# EAGLE design arm_route2 (EAGLE 7.6.0)
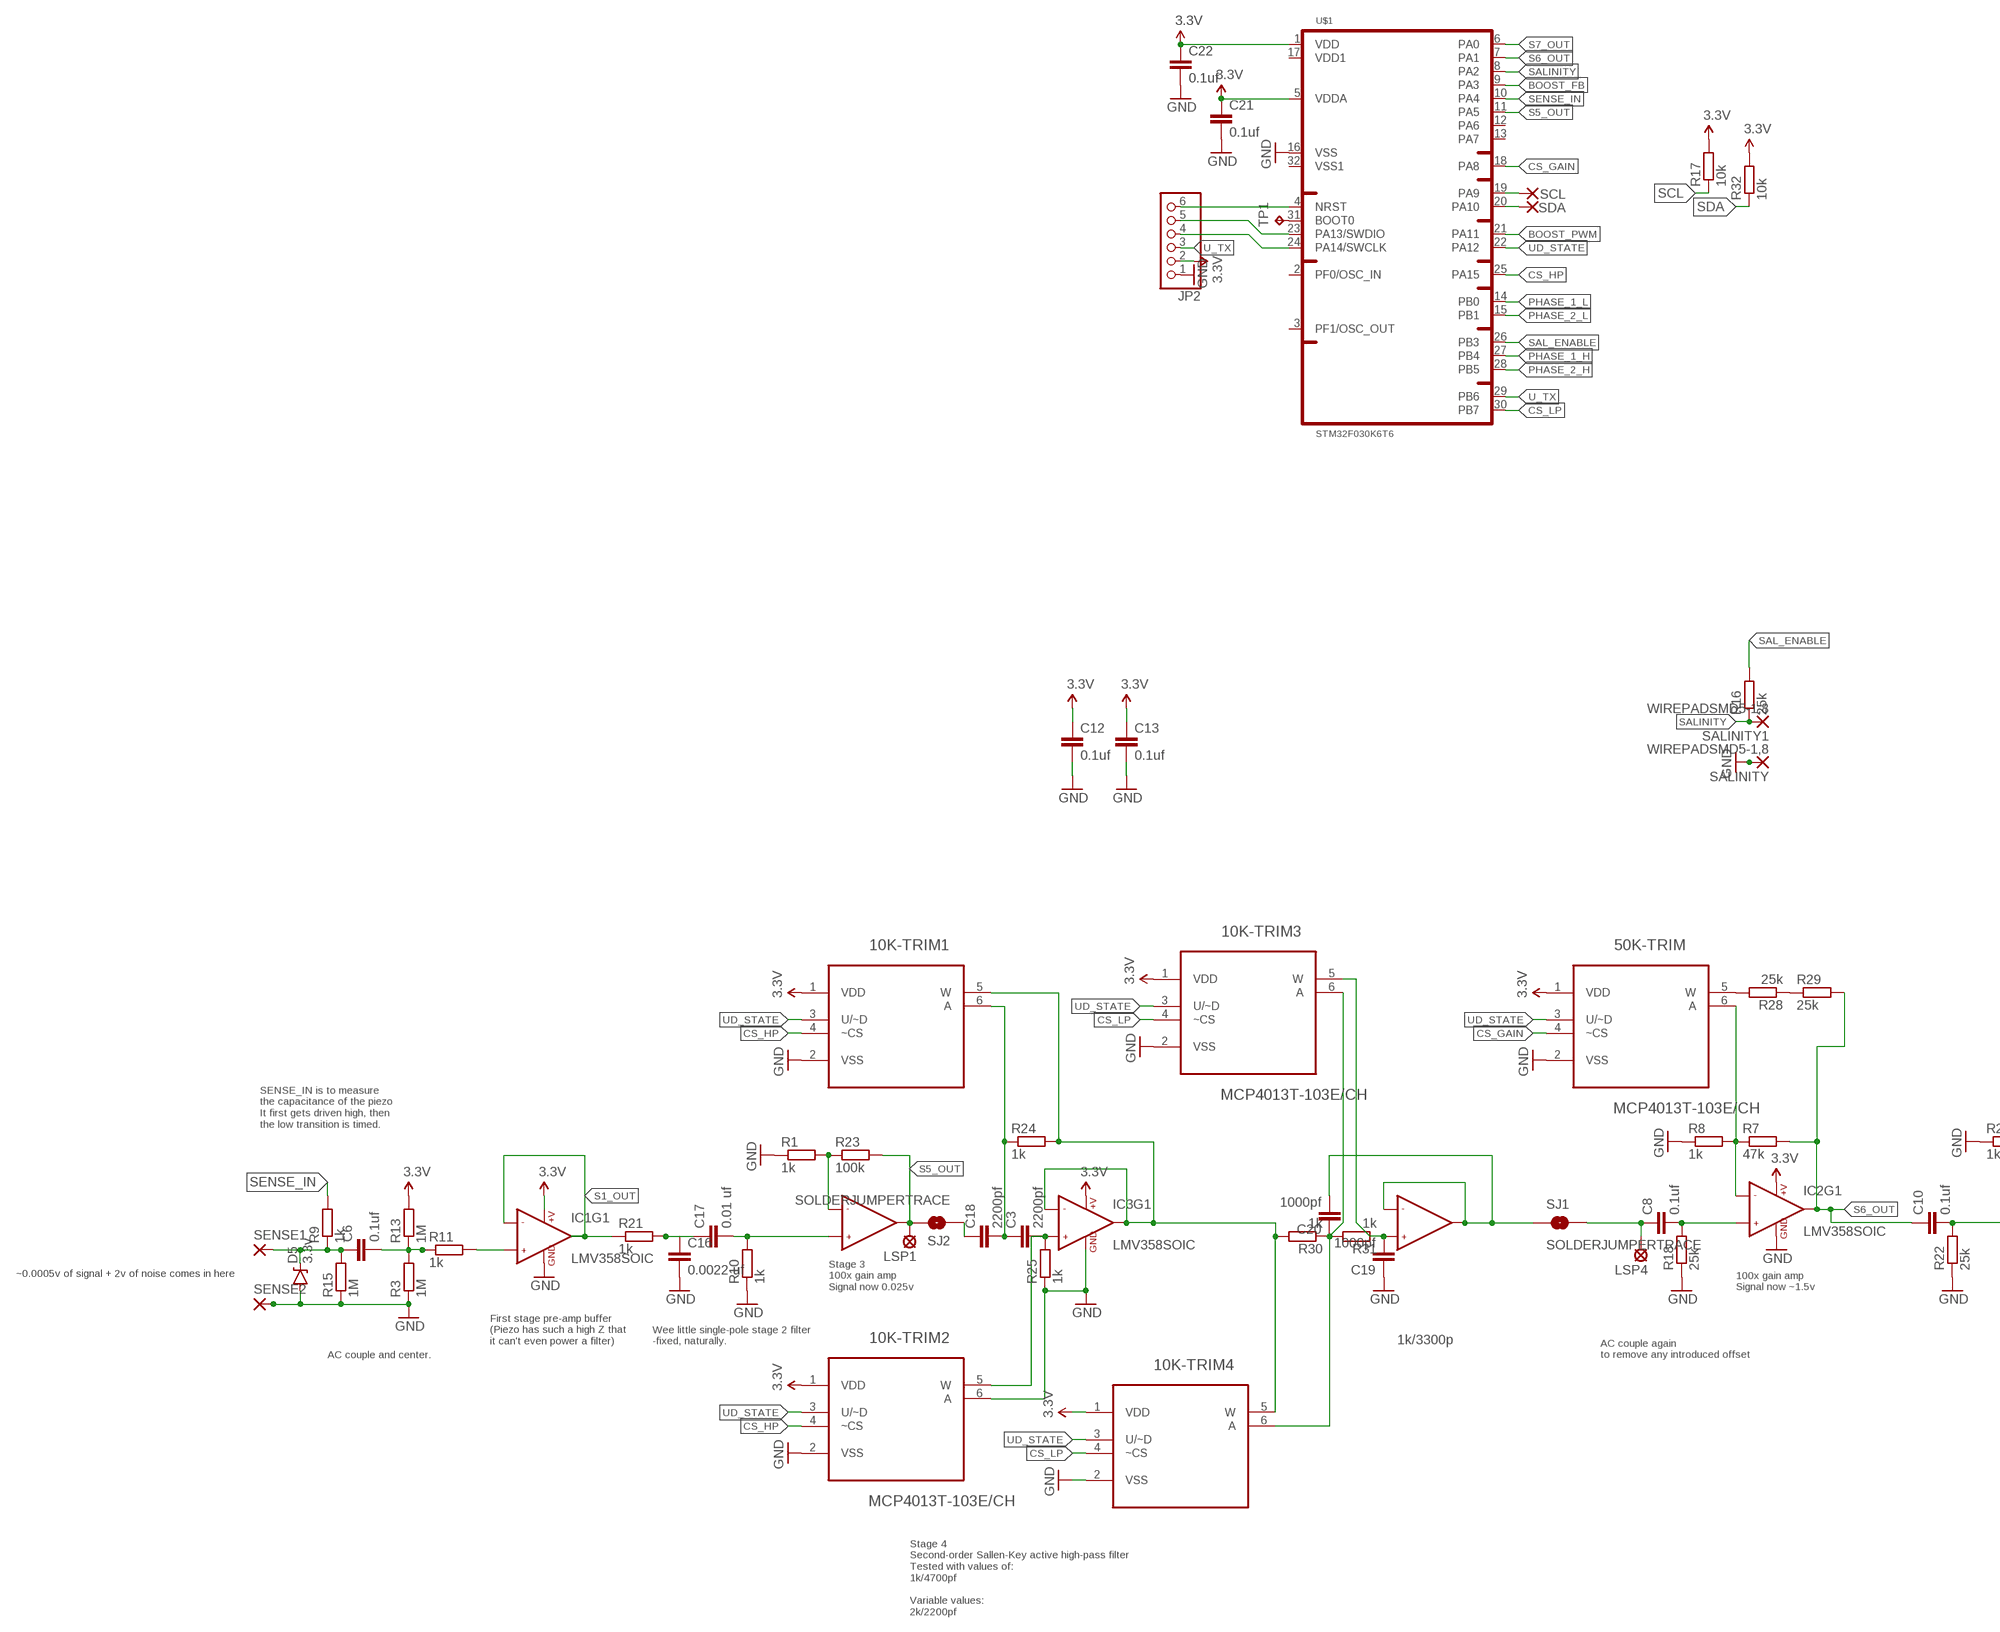
[diagram p0: schematic, sheet 1, part 1 of 2]
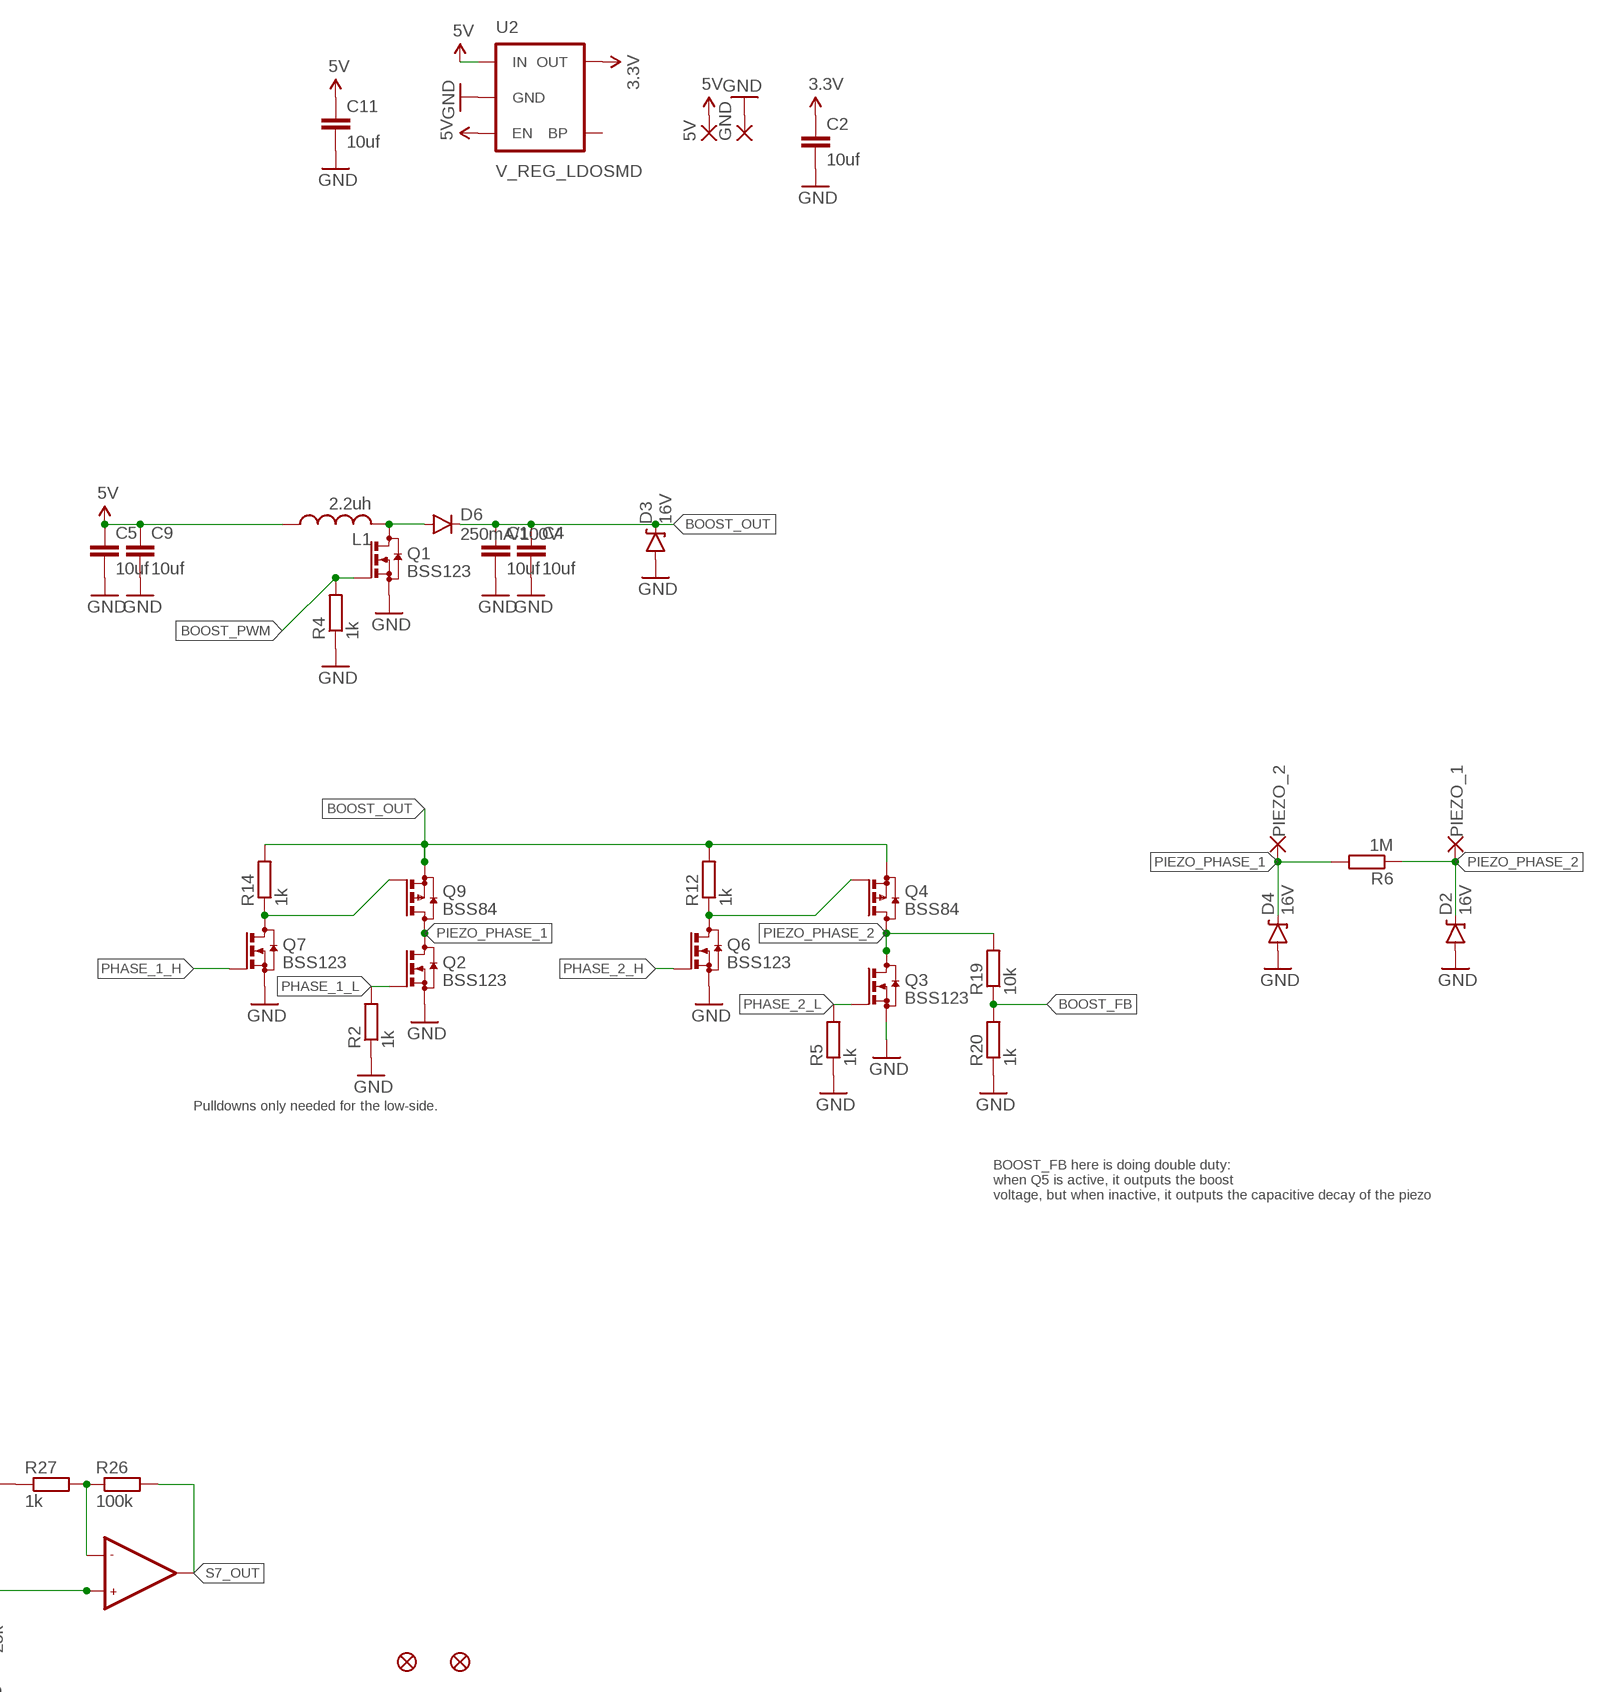
[diagram p1: schematic, sheet 1, part 2 of 2]

## Parts
5V  SMD5  [SMD2,54-5,08]
10K-TRIM1  MCP4013T-103E/CH  [SOT95P280X145-6N]
10K-TRIM2  MCP4013T-103E/CH  [SOT95P280X145-6N]
10K-TRIM3  MCP4013T-103E/CH  [SOT95P280X145-6N]
10K-TRIM4  MCP4013T-103E/CH  [SOT95P280X145-6N]
50K-TRIM  MCP4013T-103E/CH  [SOT95P280X145-6N]
C1  10uf  C-EUC0805  [C0805]
C2  10uf  C-EUC0603  [C0603]
C3  2200pf  C-EUC0603  [C0603]
C4  10uf  C-EUC0805  [C0805]
C5  10uf  C-EUC0603  [C0603]
C6  0.1uf  C-EUC0603  [C0603]
C8  0.1uf  C-EUC0603  [C0603]
C9  10uf  C-EUC0603  [C0603]
C10  0.1uf  C-EUC0603  [C0603]
C11  10uf  C-EUC0603  [C0603]
C12  0.1uf  C-EUC0603  [C0603]
C13  0.1uf  C-EUC0603  [C0603]
C16  0.0022 uf  C-EUC0603  [C0603]
C17  0.01 uf  C-EUC0603  [C0603]
C18  2200pf  C-EUC0603  [C0603]
C19  1000pf  C-EUC0603  [C0603]
C20  1000pf  C-EUC0603  [C0603]
C21  0.1uf  C-EUC0603  [C0603]
C22  0.1uf  C-EUC0603  [C0603]
D2  16V  DIODE-ZENER3.3V  [SOD-323]
D3  16V  DIODE-ZENER3.3V  [SOD-323]
D4  16V  DIODE-ZENER3.3V  [SOD-323]
D5  3.3v  DIODE-ZENER3.3V  [SOD-323]
D6  250mA/100V  DIODEBAS16  [SOD-323]
FID1  FIDUCIAL1.5X3  [FIDUCIAL-1.5X3]
FID2  FIDUCIAL1.5X3  [FIDUCIAL-1.5X3]
GND  SMD5  [SMD2,54-5,08]
IC1  LMV358SOIC  [SO08]
IC2  LMV358SOIC  [SO08]
IC3  LMV358SOIC  [SO08]
JP2  PINHD-1X6  [1X06]
L1  2.2uh  L-USL2825P  [L2825P]
LSP1  LSP10  [LSP10]
LSP4  LSP10  [LSP10]
PIEZO_1  SMD5  [SMD2,54-5,08]
PIEZO_2  SMD5  [SMD2,54-5,08]
Q1  BSS123  [SOT23]
Q2  BSS123  [SOT23]
Q3  BSS123  [SOT23]
Q4  BSS84  [SOT23]
Q6  BSS123  [SOT23]
Q7  BSS123  [SOT23]
Q9  BSS84  [SOT23]
R1  1k  R-EU_R0603  [R0603]
R2  1k  R-EU_R0603  [R0603]
R3  1M  R-EU_R0603  [R0603]
R4  1k  R-EU_R0603  [R0603]
R5  1k  R-EU_R0603  [R0603]
R6  1M  R-EU_R0603  [R0603]
R7  47k  R-EU_R0603  [R0603]
R8  1k  R-EU_R0603  [R0603]
R9  1k  R-EU_R0603  [R0603]
R10  1k  R-EU_R0603  [R0603]
R11  1k  R-EU_R0603  [R0603]
R12  1k  R-EU_R0603  [R0603]
R13  1M  R-EU_R0603  [R0603]
R14  1k  R-EU_R0603  [R0603]
R15  1M  R-EU_R0603  [R0603]
R16  25k  R-EU_R0603  [R0603]
R17  10k  R-EU_R0603  [R0603]
R18  25k  R-EU_R0603  [R0603]
R19  10k  R-EU_R0603  [R0603]
R20  1k  R-EU_R0603  [R0603]
R21  1k  R-EU_R0603  [R0603]
R22  25k  R-EU_R0603  [R0603]
R23  100k  R-EU_R0603  [R0603]
R24  1k  R-EU_R0603  [R0603]
R25  1k  R-EU_R0603  [R0603]
R26  100k  R-EU_R0603  [R0603]
R27  1k  R-EU_R0603  [R0603]
R28  25k  R-EU_R0603  [R0603]
R29  25k  R-EU_R0603  [R0603]
R30  1k  R-EU_R0603  [R0603]
R31  1k  R-EU_R0603  [R0603]
R32  10k  R-EU_R0603  [R0603]
SALINITY  WIREPADSMD5-1,8  [5-1,8]
SALINITY1  WIREPADSMD5-1,8  [5-1,8]
SCL  SMD5  [SMD2,54-5,08]
SDA  SMD5  [SMD2,54-5,08]
SENSE1  SMD5  [SMD2,54-5,08]
SENSE2  SMD5  [SMD2,54-5,08]
SJ1  SOLDERJUMPERTRACE  [SJ_2S-TRACE]
SJ2  SOLDERJUMPERTRACE  [SJ_2S-TRACE]
TP1  TPTP12R  [TP12R]
U2  V_REG_LDOSMD  [SOT23-5]
U$1  STM32F030K6T6  [LQFP-32]

## Nets
3.3V: 10K-TRIM1.1(VDD) 10K-TRIM2.1(VDD) 10K-TRIM3.1(VDD) 10K-TRIM4.1(VDD) 50K-TRIM.1(VDD) C2.1 C12.1 C13.1 C21.1 C22.1 IC1.8(+V) IC2.8(+V) IC3.8(+V) JP2.2 R13.2 R17.2 R32.2 U2.5(OUT) U$1.1(VDD) U$1.5(VDDA)
5V: 5V.1(P) C5.1 C9.1 C11.1 L1.1 U2.1(IN) U2.3(EN)
BOOST_FB: R19.1 R20.2 U$1.9(PA3)
BOOST_OUT: C1.1 C4.1 D3.C D6.C Q4.2(S) Q9.2(S) R12.2 R14.2
BOOST_PWM: Q1.1(G) R4.2 U$1.21(PA11)
CS_GAIN: 50K-TRIM.4(~CS) U$1.18(PA8)
CS_HP: 10K-TRIM1.4(~CS) 10K-TRIM2.4(~CS) U$1.25(PA15)
CS_LP: 10K-TRIM3.4(~CS) 10K-TRIM4.4(~CS) U$1.30(PB7)
GND: 10K-TRIM1.2(VSS) 10K-TRIM2.2(VSS) 10K-TRIM2.6(A) 10K-TRIM3.2(VSS) 10K-TRIM4.2(VSS) 50K-TRIM.2(VSS) C1.2 C2.2 C4.2 C5.2 C9.2 C11.2 C12.2 C13.2 C16.2 C19.1 C21.2 C22.2 D2.A D3.A D4.A D5.A GND.1(P) IC1.4(GND) IC2.4(GND) IC3.4(GND) JP2.1 Q1.2(S) Q2.2(S) Q3.2(S) Q6.2(S) Q7.2(S) R1.1 R2.1 R3.1 R4.1 R5.1 R8.1 R10.1 R15.1 R18.1 R20.1 R22.1 R25.1 R27.1 SALINITY.1(P) SENSE2.1(P) U2.2(GND) U$1.16(VSS)
N$1: C10.2 IC2.5(+IN2) R22.2
N$2: Q4.1(G) Q6.3(D) R12.1
N$3: C20.2 IC3.6(-IN2) IC3.7(OUT2) SJ1.1
N$4: Q7.3(D) Q9.1(G) R14.1
N$5: TP1.TP U$1.31(BOOT0)
N$6: D6.A L1.2 Q1.3(D)
N$7: C6.2 R3.2 R11.1 R13.1
N$8: IC1.3(+IN1) R11.2
N$9: C16.1 C17.1 R21.2
N$10: C8.1 LSP4.MP SJ1.2
N$11: IC1.6(-IN2) R1.2 R23.1
N$12: C18.1 SJ2.1
N$13: C17.2 IC1.5(+IN2) R10.2
N$15: 50K-TRIM.6(A) IC2.2(-IN1) R7.1 R8.2
N$18: C8.2 IC2.3(+IN1) R18.2
N$19: 10K-TRIM3.5(W) C19.2 IC3.5(+IN2) R31.1
N$21: 10K-TRIM2.5(W) C3.2 IC3.3(+IN1) R25.2
N$22: 10K-TRIM1.5(W) 10K-TRIM4.5(W) IC3.1(OUT1) IC3.2(-IN1) R24.2 R30.2
N$23: 10K-TRIM1.6(A) C3.1 C18.2 R24.1
N$25: IC2.6(-IN2) R26.1 R27.2
N$26: 50K-TRIM.5(W) R28.2
N$27: R28.1 R29.1
N$28: 10K-TRIM3.6(A) 10K-TRIM4.6(A) C20.1 R30.1 R31.2
N$29: JP2.6 U$1.4(NRST)
N$30: JP2.5 U$1.23(PA13/SWDIO)
N$31: JP2.4 U$1.24(PA14/SWCLK)
PHASE_1_H: Q7.1(G) U$1.27(PB4)
PHASE_1_L: Q2.1(G) R2.2 U$1.14(PB0)
PHASE_2_H: Q6.1(G) U$1.28(PB5)
PHASE_2_L: Q3.1(G) R5.2 U$1.15(PB1)
PIEZO_IN: C6.1 D5.C R9.1 R15.2 SENSE1.1(P)
PIEZO_PHASE_1: D4.C PIEZO_2.1(P) Q2.3(D) Q9.3(D) R6.2
PIEZO_PHASE_2: D2.C PIEZO_1.1(P) Q3.3(D) Q4.3(D) R6.1 R19.2
S1_OUT: IC1.1(OUT1) IC1.2(-IN1) R21.1
S5_OUT: IC1.7(OUT2) LSP1.MP R23.2 SJ2.2 U$1.11(PA5)
S6_OUT: C10.1 IC2.1(OUT1) R7.2 R29.2 U$1.7(PA1)
S7_OUT: IC2.7(OUT2) R26.2 U$1.6(PA0)
SAL_ENABLE: R16.2 U$1.26(PB3)
SALINITY: R16.1 SALINITY1.1(P) U$1.8(PA2)
SCL: R17.1 SCL.1(P) U$1.19(PA9)
SDA: R32.1 SDA.1(P) U$1.20(PA10)
SENSE_IN: R9.2 U$1.10(PA4)
U_TX: JP2.3 U$1.29(PB6)
UD_STATE: 10K-TRIM1.3(U/~D) 10K-TRIM2.3(U/~D) 10K-TRIM3.3(U/~D) 10K-TRIM4.3(U/~D) 50K-TRIM.3(U/~D) U$1.22(PA12)
Unconnected: U2.4(BP) U$1.2(PF0/OSC_IN) U$1.3(PF1/OSC_OUT) U$1.12(PA6) U$1.13(PA7) U$1.17(VDD1) U$1.32(VSS1)

## Notes on the sheet
- Pulldowns only needed for the low-side.
- BOOST_FB here is doing double duty:
  when Q5 is active, it outputs the boost
  voltage, but when inactive, it outputs the capacitive decay of the piezo
- SENSE_IN is to measure
  the capacitance of the piezo
  It first gets driven high, then 
  the low transition is timed.
- ~0.0005v of signal + 2v of noise comes in here
- Stage 3
  100x gain amp
  Signal now 0.025v
- 100x gain amp
  Signal now ~1.5v
- First stage pre-amp buffer
  (Piezo has such a high Z that 
  it can't even power a filter)
- Wee little single-pole stage 2 filter
  -fixed, naturally.
- 1k/3300p
- AC couple and center.
- AC couple again
  to remove any introduced offset
- Stage 4
  Second-order Sallen-Key active high-pass filter
  Tested with values of:
  1k/4700pf
  
  Variable values: 
  2k/2200pf

## Library data of the parts
5V GND PIEZO_1 PIEZO_2 SCL SDA SENSE1 SENSE2 = wirepad:SMD5: SMD PAD
10K-TRIM1-10K-TRIM4 50K-TRIM = MCP4013T-103E_CH:MCP4013T-103E/CH: Digital POT; DESCRIPTION: Digital Potentiometers with SPI Interface 10k, U/D single, 6-bit V, POT to GND; DIGI-KEY_PART_NUMBER: MCP4013T-103E/CHCT-ND; DIGI-KEY_PURCHASE_URL: https://www.digikey.ca/product-detail/en/microchip-technology/MCP4013T-103E-CH/MCP4013T-103E-CHCT-ND/1015697?WT.z_cid=ref_snapeda&utm_source=snapeda&utm_medium=aggregator&utm_campaign=buynow; MF: Microchip; MP: MCP4013T-103E/CH; PACKAGE: SOT-23-6 Microchip
C1-C6 C8-C13 C16-C22 = rcl:C-EU: CAPACITOR, European symbol
D2-D5 = SparkFun-DiscreteSemi:DIODE-ZENER: Zener Diode Production Part - 8199 3.4V Zener Voltage; PROD_ID: DIO-11284; VALUE: 3.3V
D6 = SparkFun-DiscreteSemi:DIODE: Diode These are standard reverse protection diodes and small signal diodes. SMA package can handle up to about 1A. SOD-323 can handle about 200mA. What the SOD-323 package when ordering, there are some mfgs out there that are 5-pin packages.; PROD_ID: DIO-09646
FID1 FID2 = SparkFun-Retired:FIDUCIAL: Fiducial Alignment Points Various fiducial points for machine vision alignment.
IC1-IC3 = SparkFun-AnalogIC:LMV358: Jellybean rail-to-rail output op-amp; PROD_ID: IC-09657
JP2 = pinhead:PINHD-1X6: PIN HEADER
L1 = rcl:L-US: INDUCTOR, American symbol
LSP1 LSP4 = solpad:LSP10: SOLDER PAD drill 1.0 mm, distributor Buerklin, 12H555
Q1-Q3 Q6 Q7 = transistor-small-signal:BSS123: N-CHANNEL MOS FET
Q4 Q9 = transistor-small-signal:BSS84: P-CHANNEL MOS FET
R1-R32 = rcl:R-EU_: RESISTOR, European symbol
SALINITY SALINITY1 = wirepad:WIREPAD: Wire PAD connect wire on PCB
SJ1 SJ2 = SparkFun-Retired:SOLDERJUMPER: Solder Jumper Standard SMD solder jumper. Used to automate production. Two varients : Normally Open and Normally Closed are the same, but have different paste layers. NC will have a large amount of paste and should jumper during reflow.
TP1 = testpad:TP: Test pad
U2 = SparkFun-PowerIC:V_REG_LDO: Voltage Regulator LDO Standard 150mA LDO voltage regulator in SOT-23 layout. Micrel part MIC5205. BP (by-pass) pin is used to lower output noise with 470pF cap.
U$1 = STM32F030K6T6:STM32F030K6T6

## Net classes
0 default: width 0.254 mm, drill 0.508 mm

## Board
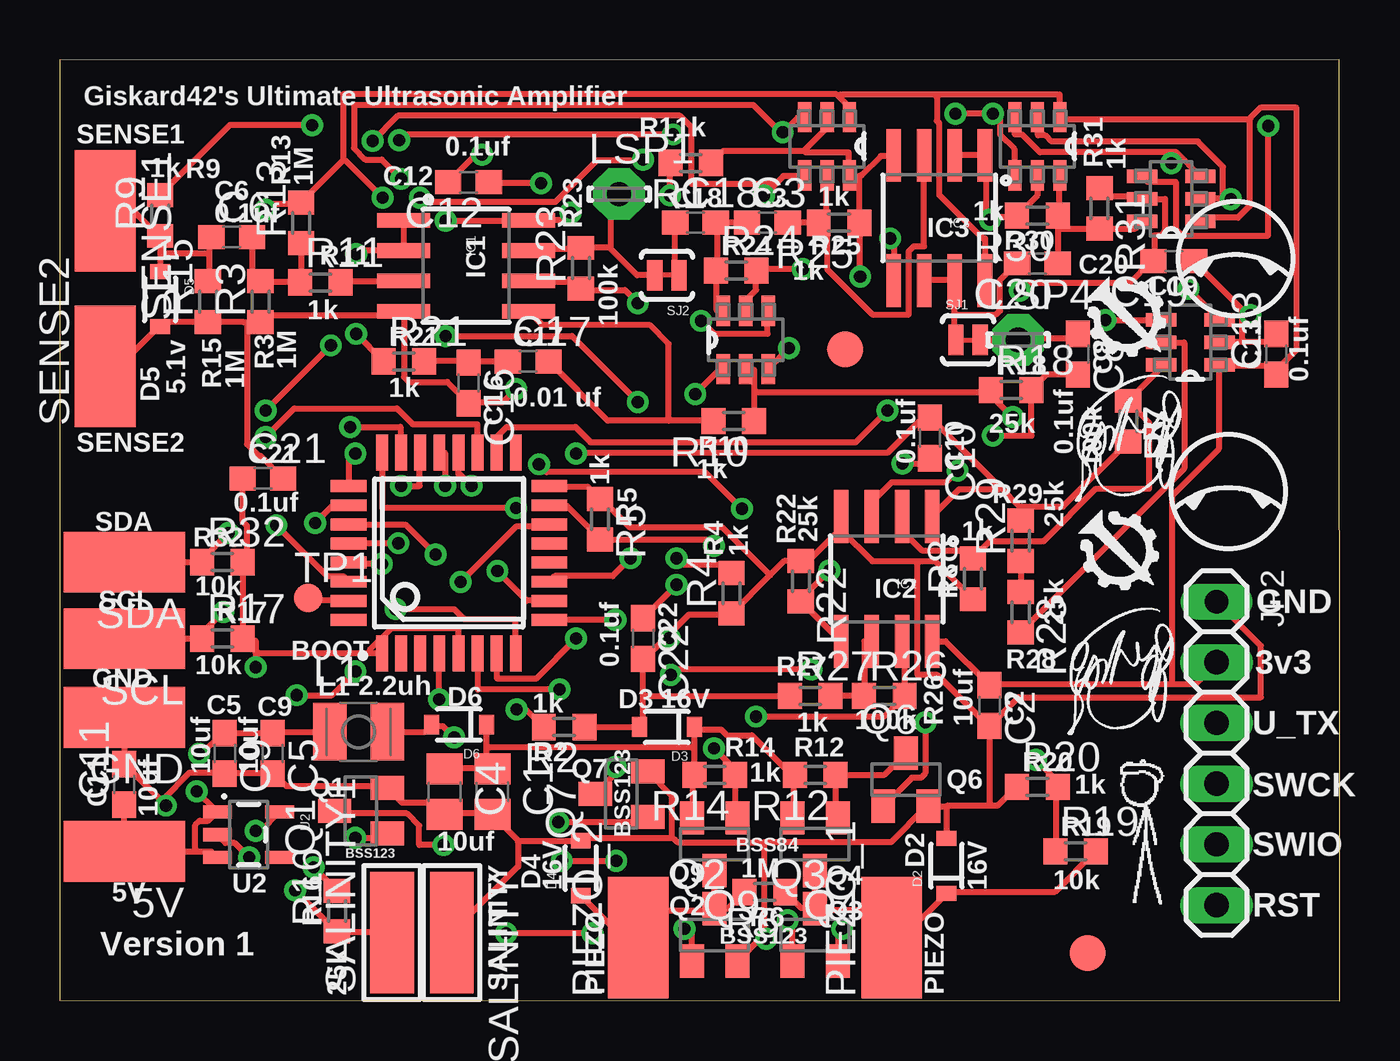
[diagram p2: board, top side]
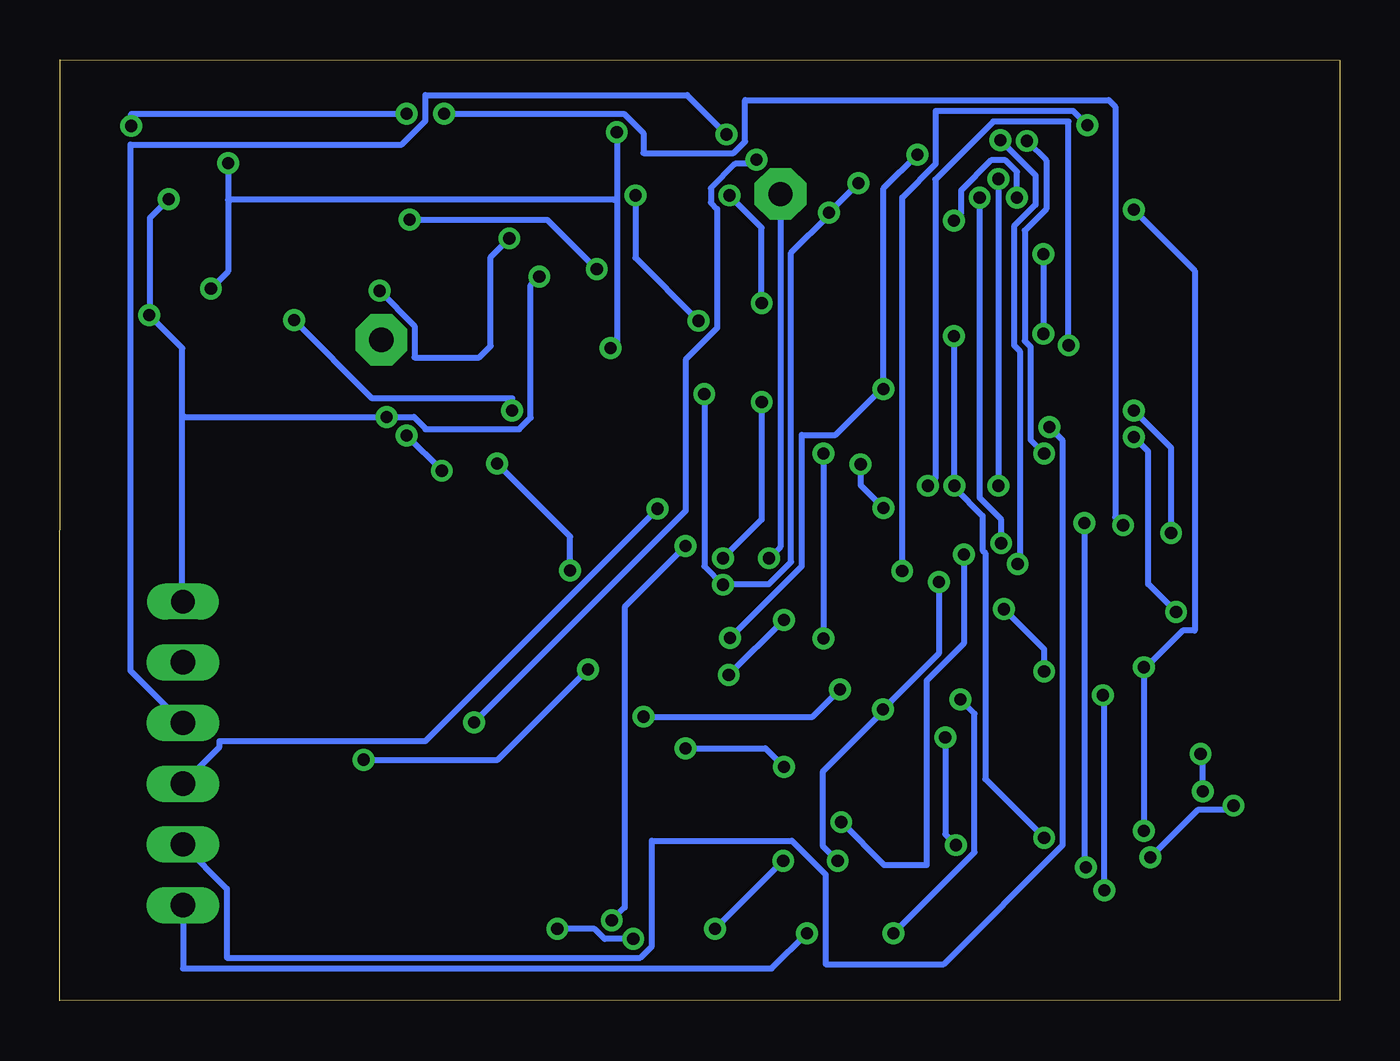
[diagram p3: board, bottom side, seen from below]

Size 53.55 x 39.38 mm. Coordinates in mm from the lower left corner, seen from the top.
Outline: 0,0.03 53.55,0 53.53,39.38 0,39.36 0,0.03
Copper layers (1*16): Top 0.035mm / dielectric 1.5mm / Bottom 0.035mm
Design rules "default *": minimum track width 10mil, minimum drill 17mil, track to track 7mil, track to pad 7mil, pad to pad 7mil, via to via 7mil, smd to smd 7mil, copper to edge 40mil, drill to drill 8mil, minimum pad ring 10mil, minimum via ring 8mil, stop-mask expansion 4mil, vias tented up to drill 0mil, thermal gap 10mil

### Footprints (pad centres in the part's own frame; a part is rotated, then mirrored left to right if it is on the bottom)
SMD2,54-5,08 = smd 2.54 x 5.08: 1 0,0
SOT95P280X145-6N = smd 1.27 x 0.559: 1 -1.219,0.94; 2 -1.219,0; 3 -1.219,-0.94; 4 1.219,-0.94; 5 1.219,0; 6 1.219,0.94
C0805 = smd 1.3 x 1.5: 1 -0.95,0; 2 0.95,0
C0603 = smd 1.1 x 1: 1 -0.85,0; 2 0.85,0
SOD-323 = smd 0.63 x 0.83: A 1.15,0; C -1.15,0
FIDUCIAL-1.5X3 = smd 1.5 x 1.5: 1 0,0
SO08 = smd 0.61 x 2.21: 1 -1.905,-2.616; 2 -0.635,-2.616; 3 0.635,-2.616; 4 1.905,-2.616; 5 1.905,2.616; 6 0.635,2.616; 7 -0.635,2.616; 8 -1.905,2.616
1X06 = drill 0.991 long: 1 -6.35,0 | drill 1.016 long: 2 -3.81,0; 3 -1.27,0; 4 1.27,0; 5 3.81,0; 6 6.35,0
L2825P = smd 1.4 x 2.4: 1 -1.2,0; 2 1.2,0
LSP10 = drill 1.016 pad 2.159 octagon: MP 0,0
SOT23 = smd 1 x 1.4: 1 -0.95,-1.1; 2 0.95,-1.1; 3 0,1.1
R0603 = smd 1 x 1.1: 1 -0.85,0; 2 0.85,0
5-1,8 = smd 1.829 x 5.08: 1 0,0
SJ_2S-TRACE = smd 0.635 x 1.27: 1 -0.508,0; 2 0.508,0
TP12R = smd 1.2 x 1.2: TP 0,0
SOT23-5 = smd 0.55 x 1.2: 1 -0.95,-1.3; 2 0,-1.3; 3 0.95,-1.3; 4 0.95,1.3; 5 -0.95,1.3
LQFP-32 = smd 0.5 x 1.5: 1 2.28,0.88; 2 3.08,0.88; 3 3.88,0.88; 4 4.68,0.88; 5 5.48,0.88; 6 6.28,0.88; 7 7.08,0.88; 8 7.88,0.88; 17 7.88,9.28; 18 7.08,9.28; 19 6.28,9.28; 20 5.48,9.28; 21 4.68,9.28; 22 3.88,9.28; 23 3.08,9.28; 24 2.28,9.28 | smd 1.5 x 0.5: 9 9.28,2.28; 10 9.28,3.08; 11 9.28,3.88; 12 9.28,4.68; 13 9.28,5.48; 14 9.28,6.28; 15 9.28,7.08; 16 9.28,7.88; 25 0.88,7.88; 26 0.88,7.08; 27 0.88,6.28; 28 0.88,5.48; 29 0.88,4.68; 30 0.88,3.88; 31 0.88,3.08; 32 0.88,2.28

### Placement (x,y rotation side)
5V  2.7,6.26 90 top
10K-TRIM1  28.7,27.66 90 top
10K-TRIM2  32.1,35.76 270 top
10K-TRIM3  46.5,33.56 180 top
10K-TRIM4  40.9,35.76 270 top
50K-TRIM  47.3,27.56 180 top
C1  18.1,8.76 270 top
C2  38.9,12.36 270 top
C3  29.6,32.56 0 top
C4  16.1,8.76 270 top
C5  8.9,10.36 270 top
C6  7.2,31.96 0 top
C8  42.6,27.06 270 top
C9  6.9,10.36 270 top
C10  36.4,23.56 270 top
C11  2.7,9.06 90 top
C12  17.1,34.26 180 top
C13  50.9,27.06 90 top
C16  17.1,25.86 270 top
C17  19.6,26.76 0 top
C18  26.6,32.56 0 top
C19  46.6,30.96 180 top
C20  40.9,30.86 180 top
C21  8.5,21.86 0 top
C22  24.4,15.16 270 top
D2  37.1,5.66 90 top
D3  25.4,11.46 180 top
D4  21.8,5.56 90 top
D5  4.2,29.36 270 top
D6  16.7,11.56 180 top
FID1  43,2.01 0 top
FID2  32.85,27.26 0 top
GND  2.7,11.86 90 top
IC1  17,30.76 270 top
IC2  34.6,17.66 180 top
IC3  36.8,32.76 180 top
JP2  48.4,10.36 270 top
L1  12.5,11.26 0 top
LSP1  23.4,33.76 0 top
LSP4  40.1,27.66 0 top
PIEZO_1  34.8,2.66 0 top
PIEZO_2  24.2,2.66 0 top
Q1  12.6,7.96 90 top
Q2  27.4,2.76 0 top
Q3  31.6,2.76 0 top
Q4  31.6,6.56 180 top
Q6  35.4,9.26 0 top
Q7  23.5,8.66 90 top
Q9  27.4,6.56 180 top
R1  26.4,35.06 180 top
R2  21.1,11.46 180 top
R3  8.4,29.26 90 top
R4  28.1,17.06 90 top
R5  22.6,20.16 270 top
R6  29.5,4.56 180 top
R7  44.7,24.26 270 top
R8  38.2,17.66 90 top
R9  4.2,32.86 90 top
R10  28.2,24.26 180 top
R11  10.9,30.06 0 top
R12  31.6,9.46 180 top
R13  10.1,32.56 90 top
R14  27.4,9.46 180 top
R15  6.2,29.26 90 top
R16  11.6,3.76 90 top
R17  6.8,15.16 0 top
R18  39.8,25.56 0 top
R19  42.5,6.26 0 top
R20  40.9,8.96 0 top
R21  14.4,26.76 0 top
R22  31,17.56 270 top
R23  21.8,30.66 90 top
R24  28.3,30.56 0 top
R25  32.6,32.56 180 top
R26  34.5,12.76 0 top
R27  31.4,12.76 0 top
R28  40.2,16.26 270 top
R29  40.2,19.26 90 top
R30  40.9,32.86 180 top
R31  43.5,33.16 270 top
R32  6.8,18.36 0 top
SALINITY  16.4,2.86 180 top
SALINITY1  13.9,2.86 0 top
SCL  2.7,15.16 90 top
SDA  2.7,18.36 90 top
SENSE1  1.9,33.06 180 top
SENSE2  1.9,26.56 0 top
SJ1  38,27.66 0 top
SJ2  25.4,30.36 180 top
TP1  10.4,16.86 0 top
U2  7.9,6.96 270 top
U$1  11.2,13.66 0 top

### Tracks (layer width: path | path; a pad name or v marks a point on that pad's centre or on a via)
3.3V  (via drill 0.51)
  Top 0.254: v20.13,34.21 18,34.21 17.97,34.24 C12.1 | v21.36,32.98 21.06,32.68 19.62,32.68 IC1.8 19.5,32.65 v16.14,32.65 | v25.8,17.41 24.42,16.03 C22.1 | v26.58,25.39 27.6,26.41 27.75,26.41 10K-TRIM1.1 | C21.1 7.65,20.05 7.83,19.87 7.83,18.46 7.71,18.46 R32.2 7.65,18.34 R17.2 7.74,15.07 8.19,15.07 8.19,14.56 | v8.19,7.12 8.4,7.12 9.18,7.9 U2.5 | 8.19,14.56 v8.19,13.96 | 12.96,14.56 8.31,14.56 8.19,14.56 | 12.96,14.56 13.47,14.56 U$1.1 | U$1.5 16.65,14.56 16.65,15.61 13.89,15.61 12.96,14.68 12.96,14.56 | IC2.8 37.05,15.04 38.88,13.21 C2.1 39,13.27 46.53,13.27 | 46.53,13.27 47.52,13.27 48.39,14.14 JP2.2 | 11.85,35.17 10.11,33.43 R13.2 9.99,33.34 8.85,33.34 v8.61,33.1 | 11.85,35.17 11.85,37.93 32.49,37.93 32.57,37.86 | 32.57,37.86 33.03,37.39 33.03,37 10K-TRIM2.1 | 36.69,37.93 32.64,37.93 32.57,37.86 | 36.69,37.93 41.82,37.93 41.82,37 10K-TRIM4.1 41.91,36.88 49.77,36.88 | 49.77,36.88 49.77,33.25 49.29,32.77 47.88,32.77 47.73,32.62 10K-TRIM3.1 | 49.77,36.88 49.83,36.97 50.25,37.39 51.72,37.39 51.72,27.22 50.88,26.38 C13.1 50.88,26.23 50.52,26.59 48.54,26.59 50K-TRIM.1 48.48,26.47 48.48,23.08 46.53,21.13 46.53,13.39 46.53,13.27 | IC3.8 38.7,30.16 38.7,31.9 38.61,31.9 36.78,33.73 36.78,36.73 36.69,36.82 36.69,37.81 36.69,37.93 | v13.5,33.61 11.97,35.14 11.85,35.17
  Bottom 0.254: v20.13,34.21 v21.36,32.98 21.39,32.86 22.95,31.3 22.95,18.37 23.88,17.44 25.68,17.44 v25.8,17.41 26.58,18.19 v26.58,25.39 | v8.19,7.12 v8.19,13.96 8.07,13.99 6.57,15.49 6.06,15.49 6.06,30.55 v8.61,33.1 | v16.14,32.65 15.84,32.95 15.84,33.91 14.58,35.17 13.98,35.17 13.5,34.69 v13.5,33.61
5V  (via drill 0.51)
  Top 0.254: L1.1 11.28,11.23 9,11.23 C5.1 8.88,11.2 C9.1 6.78,11.17 5.94,10.33 v5.82,10.33 | C11.1 2.7,6.28 5V.1 2.82,6.25 5.67,6.25 | 5.67,6.25 6.33,6.25 6.57,6.01 U2.3 | 5.67,6.25 5.67,6.37 5.67,7.36 5.85,7.54 6.21,7.54 6.57,7.9 U2.1 6.51,7.99 v5.73,8.77
  Bottom 0.254: v5.82,10.33 5.73,10.24 v5.73,8.77
BOOST_FB  (via drill 0.51)
  Top 0.254: R19.1 41.67,6.28 41.67,8.95 41.73,8.95 R20.2 41.64,9.07 41.64,9.28 v40.83,10.09 | v23.25,15.94 U$1.9 | v25.56,13.63 25.8,13.87 v31.44,13.87
  Bottom 0.254: v25.56,13.63 v23.25,15.94 | v31.44,13.87 35.22,10.09 v40.83,10.09
BOOST_OUT
  Top 0.254: 17.85,10.6 17.85,9.73 18.09,9.73 C1.1 17.73,9.73 16.11,9.73 C4.1 | 17.85,10.6 17.85,11.53 D6.C | Q4.2 30.72,7.66 30.72,9.43 R12.2 30.6,9.46 28.95,11.11 27.9,11.11 27.66,11.35 26.67,11.35 D3.C 26.55,11.44 26.55,10.6 | 26.55,10.6 R14.2 26.46,9.37 Q9.2 | 17.85,10.6 17.97,10.6 26.43,10.6 26.55,10.6
BOOST_PWM  (via drill 0.51)
  Top 0.254: v25.8,18.52 26.07,18.25 27.75,18.25 28.08,17.92 R4.2 | v24.18,25.06 21.42,27.82 v16.14,27.82 | v16.11,21.55 16.11,22.93 15.9,22.93 U$1.21 | v12.36,6.82 13.5,6.82 13.68,7 Q1.1
  Bottom 0.254: v25.8,18.52 24.18,20.14 v24.18,25.06 | v16.14,27.82 16.11,27.79 v16.11,21.55 16.08,21.43 14.94,20.29 14.94,18.85 14.82,18.73 14.82,9.28 v12.36,6.82
CS_GAIN  (via drill 0.51)
  Top 0.254: v43.74,28.48 46.05,28.48 50K-TRIM.4 | v34.62,24.7 33.3,23.38 22.2,23.38 21.57,24.01 18.69,24.01 18.3,23.62 18.3,22.96 U$1.18
  Bottom 0.254: v43.74,28.48 40.47,25.21 34.62,25.21 v34.62,24.7
CS_HP  (via drill 0.51)
  Top 0.254: v26.82,28.45 27.36,27.91 29.61,27.91 29.61,28.87 10K-TRIM1.4 | 29.87,34.11 30.27,34.51 31.14,34.51 10K-TRIM2.4 | 29.87,34.11 v29.46,33.7 | v12.36,22.9 12.09,22.9 U$1.25 | v13.08,35.98 14.13,37.03 25.95,37.03 26.43,36.55 26.43,34.18 29.79,34.18 29.87,34.11
  Bottom 0.254: v26.82,28.45 29.46,31.09 v29.46,33.7 | v12.36,22.9 12.93,23.47 12.93,27.37 13.17,27.61 13.17,32.23 12.27,33.13 12.27,35.17 v13.08,35.98
CS_LP  (via drill 0.51)
  Top 0.254: v50.55,36.61 50.55,32.02 46.95,32.02 46.68,32.29 46.68,34.27 45.51,34.27 45.3,34.48 10K-TRIM3.4 | 10K-TRIM4.4 39.93,34.54 39.93,35.65 39.33,36.25 39.33,37.12 v39.03,37.12 38.91,37.12 v37.47,37.12 | v9.06,19.9 11.19,17.77 11.85,17.77 12.06,17.56 U$1.30
  Bottom 0.254: v39.03,37.12 50.55,37.12 v50.55,36.61 | v9.06,19.9 9.39,20.23 9.39,37.42 9.66,37.69 24.87,37.69 24.87,35.95 25.35,35.47 29.13,35.47 29.13,36.31 29.94,37.12 v37.47,37.12
GND  (via drill 0.51)
  Top 0.254: GND.1 2.7,11.83 C11.2 2.79,9.82 v4.44,8.17 4.32,8.44 5.43,9.55 6.78,9.55 C9.2 8.88,9.52 C5.2 9,9.46 9.48,8.98 13.59,8.98 Q1.2 13.71,8.89 14.31,8.29 15.6,8.29 16.08,7.81 C4.2 16.2,7.84 17.97,7.84 C1.2 18.12,7.78 19.2,6.7 | v7.92,6.01 7.32,6.61 6.93,6.61 6.6,6.94 U2.2 | 19.2,6.7 21.78,6.7 D4.A 21.84,6.82 25.62,6.82 | 25.62,6.82 25.62,8.56 24.6,9.58 Q7.2 | 29.42,2.73 29.46,2.77 29.46,6.64 | 29.42,2.73 Q2.2 | 29.46,6.64 25.83,6.64 25.71,6.76 25.62,6.82 | v32.73,3.01 32.55,3.01 Q3.2 | v29.55,2.59 29.49,2.65 29.42,2.73 | SALINITY.1 19.17,5.62 19.17,6.58 19.2,6.7 | v17.67,35.41 17.4,35.41 C12.2 | v19.08,25.6 18.54,25.06 17.22,25.06 C16.2 17.07,25.03 16.2,25.9 14.61,25.9 14.4,26.11 14.4,28.84 IC1.4 14.28,28.69 8.7,28.69 8.49,28.48 R3.1 8.37,28.39 7.83,28.39 | 7.83,28.39 7.83,23.29 8.31,22.81 8.4,22.81 9.33,21.88 C21.2 | 7.83,28.39 7.71,28.39 6.3,28.39 R15.1 6.18,28.39 4.38,28.39 D5.A 4.08,28.15 2.49,26.56 1.92,26.56 SENSE2.1 | R2.1 D3.A 24.33,11.56 24.39,11.56 24.39,12.76 | 24.39,12.76 24.39,14.29 C22.2 24.51,14.35 25.43,15.27 | R27.1 24.51,12.76 24.39,12.76 | 35.88,18.4 33.99,18.4 32.7,19.69 IC2.4 32.58,19.66 31.38,18.46 31.11,18.46 R22.1 30.3,18.4 29.72,17.82 | 35.88,18.4 36.6,18.4 R8.1 | U$1.16 20.49,21.52 22.08,21.52 R5.1 22.71,20.95 23.85,19.81 27.72,19.81 29.64,17.89 29.72,17.82 | 29.72,17.82 R4.1 27.99,16.15 26.31,16.15 25.43,15.27 | 33.42,34.51 33.42,32.56 R25.1 33.48,32.44 v33.48,30.31 | 33.42,34.51 33.06,34.51 10K-TRIM2.6 33,34.66 33,35.5 31.2,35.5 31.11,35.56 | 33.42,34.51 33.54,34.54 34.35,35.35 34.89,35.35 IC3.4 | 31.11,35.56 27.75,35.56 27.27,35.08 R1.1
  Top 0.254: 31.11,35.56 32.07,36.52 32.07,36.97 10K-TRIM2.2 | 29.04,25.48 29.04,26.41 28.71,26.41 10K-TRIM1.2 | 29.04,25.48 29.04,24.28 R10.1 | 29.04,25.48 29.16,25.48 38.88,25.48 38.94,25.54 R18.1 38.91,25.36 39.84,24.43 v39.87,24.43 | 48.66,33.58 48.66,34.9 47.61,35.95 41.49,35.95 41.22,36.22 40.92,36.22 40.92,36.97 10K-TRIM4.2 | 48.66,33.58 47.73,33.58 10K-TRIM3.2 | 49.47,27.58 48.54,27.58 50K-TRIM.2 | 49.47,27.58 50.58,27.58 50.88,27.88 C13.2 | 49.47,28.69 49.47,27.7 49.47,27.58 | 49.47,28.69 49.47,28.93 47.46,30.94 C19.1 | 37.08,8.14 37.08,6.82 D2.A | 37.08,8.14 36.36,8.14 Q6.2 36.24,8.11 34.77,6.64 29.58,6.64 29.46,6.64 | 38.91,8.17 37.2,8.17 37.08,8.14 | 38.91,8.17 39.24,8.17 40.02,8.95 R20.1 | C2.2 38.91,8.29 38.91,8.17 | JP2.1 48.42,16.69 50.25,14.86 50.25,12.7 40.11,12.7 39,11.59 C2.2 | v49.8,28.69 49.59,28.69 49.47,28.69 | v48.99,33.55 48.78,33.55 48.66,33.58 | 35.88,18.4 35.88,18.28 35.88,13.63 36.72,13.63 38.79,11.56 C2.2 | v25.5,15.19 25.43,15.27
  Bottom 0.254: v7.92,6.01 5.94,7.99 4.44,7.99 v4.44,8.17 | v32.73,3.01 31.17,3.01 30.75,2.59 v29.55,2.59 | v17.67,35.41 19.08,34 v19.08,25.6 19.2,25.57 21.09,23.68 22.5,23.68 22.5,18.19 v25.5,15.19 | 48.42,24.43 48.42,16.72 JP2.1 | 48.42,24.43 48.42,27.31 v49.8,28.69 49.77,28.81 49.77,32.77 v48.99,33.55 | 48.42,24.43 48.3,24.43 v39.87,24.43 39.75,24.43 38.73,24.43 38.25,23.95 38.25,23.92 34.32,23.92 33.84,24.4 33.84,29.95 v33.48,30.31
N$1  (via drill 0.51)
  Top 0.254: IC2.5 32.67,15.07 32.64,15.07 31.02,16.69 R22.2 31.02,16.84 v32.19,18.01 | v35.25,22.48 36.18,22.48 36.39,22.69 C10.2 | IC2.5 32.7,15.07 IC2.5
  Bottom 0.254: v35.25,22.48 32.19,19.42 v32.19,18.01
N$2
  Top 0.254: Q4.1 32.52,7.66 32.46,7.66 32.46,9.43 R12.1 32.58,9.46 34.5,9.46 35.37,10.33 Q6.3
N$3
  Top 0.254: SJ1.1 37.43,27.66 37.43,28.72 | 37.43,28.72 IC3.7 37.32,30.16 36.18,30.16 IC3.6 | C20.2 40.02,30.85 39.33,30.16 39.33,28.87 39.3,28.87 39.15,28.72 37.53,28.72 37.43,28.72
N$4  (via drill 0.51)
  Top 0.254: Q9.1 28.32,7.66 28.26,7.66 28.26,9.43 R14.1 28.23,9.58 28.23,9.7 v27.36,10.57 | v23.25,9.79 23.25,9.52 22.41,8.68 Q7.3
  Bottom 0.254: v23.25,9.79 24.03,10.57 v27.36,10.57
N$5
  Top 0.254: TP1.TP 10.41,16.84 10.5,16.75 12.06,16.75 U$1.31
N$6  (via drill 0.51)
  Top 0.254: L1.2 15.27,11.26 15.54,11.53 D6.A 15.66,11.5 16.02,11.5 v16.5,11.02 | v16.05,6.52 15.03,6.52 15.03,7.33 14.52,7.84 11.61,7.84 11.52,7.93 Q1.3
  Bottom 0.254: v16.05,6.52 16.5,6.97 v16.5,11.02
N$7
  Top 0.254: C6.2 8.07,31.93 8.07,30.22 8.34,30.22 R3.2 9.99,30.1 10.02,30.07 R11.1 10.11,30.16 10.11,31.69 R13.1
N$8
  Top 0.254: R11.2 11.79,30.1 14.37,30.1 IC1.3
N$9
  Top 0.254: C17.1 18.72,26.74 17.13,26.74 C16.1 16.98,26.77 15.27,26.77 R21.2
N$10
  Top 0.254: SJ1.2 LSP4.MP 40.2,27.73 42.42,27.73 42.57,27.88 C8.1
N$11  (via drill 0.51)
  Top 0.254: IC1.6 19.62,30.1 21.51,30.1 21.78,29.83 R23.1 21.9,29.74 23.64,29.74 v24.18,29.2 | v25.53,33.7 25.53,35.05 R1.2
  Bottom 0.254: v25.53,33.7 24.18,32.35 v24.18,29.2
N$12
  Top 0.254: SJ2.1 25.75,30.36 C18.1
N$13
  Top 0.254: 25.47,24.28 27.33,24.28 R10.2 | 25.47,24.28 22.92,24.28 20.46,26.74 C17.2 | IC1.5 20.19,28.27 24.69,28.27 25.47,27.49 25.47,24.4 25.47,24.28
N$15
  Top 0.254: 50K-TRIM.6 46.05,26.59 46.05,26.47 R7.1 44.76,25 45.57,24.19 45.57,21.43 43.35,21.43 41.16,19.24 38.91,19.24 38.28,18.61 R8.2 | R8.2 | R8.2 38.07,18.55 37.77,18.85 36.06,18.85 35.25,19.66 35.25,20.26 IC2.2
N$18  (via drill 0.51)
  Top 0.254: C8.2 42.57,26.2 41.28,26.2 R18.2 40.65,25.45 40.65,23.65 v39.03,23.65 | v37.56,22.18 37.08,21.7 34.8,21.7 33.99,20.89 33.99,20.29 IC2.3
  Bottom 0.254: v37.56,22.18 v39.03,23.65
N$19  (via drill 0.51)
  Top 0.254: C19.2 | C19.2 45.78,31.09 45.78,32.02 46.05,32.02 46.23,32.2 46.23,33.55 45.3,33.55 10K-TRIM3.5 45.18,33.64 43.86,33.64 R31.1 | v34.74,31.9 34.89,31.9 34.89,30.16 IC3.5 | v40.17,29.71 40.5,30.04 44.76,30.04 45.63,30.91 C19.2
  Bottom 0.254: v34.74,31.9 35.52,31.12 35.52,27.4 36,26.92 38.7,26.92 38.7,28.24 v40.17,29.71
N$21
  Top 0.254: R25.2 C3.2 | R25.2 | R25.2 | R25.2 | 10K-TRIM2.5 32.07,34.51 32.07,32.65 31.83,32.65 R25.2 | IC3.3 36.15,35.35 36.15,31.57 35.73,31.57 35.52,31.36 35.52,28.72 33.99,28.72 32.1,30.61 32.1,32.53 R25.2
N$22  (via drill 0.51)
  Top 0.254: IC3.2 IC3.1 38.76,35.26 38.76,32.92 39,32.92 v38.91,32.68 39.03,32.8 39.93,32.8 R30.2 40.89,33.7 40.89,34.51 10K-TRIM4.5 | 10K-TRIM1.5 28.71,28.9 28.71,29.32 29.13,29.74 29.13,30.55 R24.2 29.25,30.61 v31.08,30.61
  Bottom 0.254: v31.08,30.61 33.15,32.68 v38.91,32.68
N$23
  Top 0.254: C3.1 C18.2 27.51,32.44 27.51,30.67 R24.1 | R24.1 | R24.1 27.48,30.43 27.48,28.9 27.75,28.9 10K-TRIM1.6
N$25
  Top 0.254: R27.2 33.63,12.76 R26.1 33.66,12.88 33.66,15.04 IC2.6 | IC2.6
N$26
  Top 0.254: R28.2 40.2,15.43 47.04,22.27 47.04,27.55 50K-TRIM.5
N$27
  Top 0.254: R28.1 R29.1
N$28
  Top 0.254: C20.1 41.76,30.88 C20.1 | C20.1 41.76,31 41.76,32.83 R30.1 | R30.1 41.88,32.32 43.47,32.32 R31.2 43.62,32.32 45,32.32 45.27,32.59 10K-TRIM3.6 | 10K-TRIM4.6 41.82,34.51 41.82,32.95 R30.1
N$29  (via drill 0.51)
  Top 0.254: v15.87,12.61 U$1.4 | v22.29,2.83 v18.66,2.83
  Bottom 0.254: v15.87,12.61 15.27,12.01 15.27,6.22 v18.66,2.83 | v22.29,2.83 23.76,1.36 48.39,1.36 JP2.6
N$30  (via drill 0.51)
  Top 0.254: v12.15,24.01 14.25,24.01 14.25,22.96 U$1.23
  Bottom 0.254: v12.15,24.01 11.58,23.44 11.58,6.52 16.56,1.54 21.51,1.54 21.51,5.29 22.92,6.7 28.77,6.7 28.77,2.29 29.25,1.81 46.56,1.81 46.56,4.69 48.39,6.52 JP2.5
N$31  (via drill 0.51)
  Top 0.254: v19.08,20.62 13.5,20.62 13.5,22.93 U$1.24 | v20.04,22.45 20.37,22.12 27,22.12 v28.53,20.59
  Bottom 0.254: v19.08,20.62 20.04,21.58 v20.04,22.45 | v28.53,20.59 38.25,10.87 46.86,10.87 46.86,10.63 JP2.4
PHASE_1_H  (via drill 0.51)
  Top 0.254: v20.85,7.48 24.36,7.48 24.57,7.69 Q7.1 | v15.72,18.67 14.46,19.93 U$1.27
  Bottom 0.254: v20.85,7.48 19.05,5.68 17.28,5.68 17.28,13.39 15.72,14.95 v15.72,18.67
PHASE_1_L  (via drill 0.51)
  Top 0.254: v19.11,12.19 19.5,12.19 20.22,11.47 R2.2 | v16.77,17.53 19.08,19.84 20.37,19.84 20.46,19.93 U$1.14 | v26.13,3.01 26.43,3.01 26.43,1.66 Q2.1 | v21,5.86 v23.28,5.86
  Bottom 0.254: v16.77,17.53 16.77,14.53 v19.11,12.19 19.14,12.07 21.63,9.58 21.63,6.49 v21,5.86 | v23.28,5.86 v26.13,3.01
PHASE_2_H  (via drill 0.51)
  Top 0.254: v36.21,11.65 36.21,9.52 36.03,9.34 35.64,9.34 34.47,8.17 Q6.1 | v24.39,35.2 24.36,35.17 22.47,35.17 20.73,33.43 15.24,33.43 v15.06,33.61 | v14.16,19.15 U$1.28
  Bottom 0.254: v36.21,11.65 27.36,20.5 27.36,26.83 26.04,28.15 26.04,33.13 26.31,33.4 26.31,34 25.29,35.02 24.39,35.02 v24.39,35.2 | v15.06,33.61 15.06,21.04 14.16,20.14 v14.16,19.15
PHASE_2_L  (via drill 0.51)
  Top 0.254: U$1.15 20.49,20.71 21.21,20.71 22.59,19.33 R5.2 22.71,19.3 27.09,19.3 v27.36,19.03 | v30.45,3.37 30.63,3.37 30.63,1.66 Q3.1
  Bottom 0.254: v30.45,3.37 29.91,3.91 29.91,16.48 v27.36,19.03
PIEZO_IN
  Top 0.254: 4.2,31.27 4.2,31.99 R9.1 4.08,32.05 3.09,33.04 1.92,33.04 SENSE1.1 | 4.2,31.27 D5.C | R15.2 6.21,30.13 R15.2 | 6.24,31.27 6.24,31.93 6.33,31.93 C6.1 | 6.24,31.27 6.24,30.25 R15.2 | 4.2,31.27 4.32,31.27 6.12,31.27 6.24,31.27
PIEZO_PHASE_1
  Top 0.254: R6.2 28.62,4.54 27.96,3.88 27.42,3.88 Q2.3 | Q9.3 27.39,5.44 27.39,4 Q2.3 | D4.C 21.81,4.39 23.52,2.68 24.18,2.68 PIEZO_2.1 24.33,2.68 25.44,3.79 27.24,3.79 27.27,3.82 Q2.3
PIEZO_PHASE_2
  Top 0.254: R6.1 30.36,4.54 31.02,3.88 31.59,3.88 Q3.3 | Q4.3 31.59,5.44 31.59,4 Q3.3 | R19.2 43.32,6.25 41.64,4.57 37.2,4.57 D2.C 37.08,4.48 35.28,2.68 34.8,2.68 PIEZO_1.1 34.71,2.77 33.69,3.79 31.74,3.79 31.71,3.82 Q3.3
S1_OUT  (via drill 0.51)
  Top 0.254: v12.39,27.91 13.53,26.77 R21.1 | v12.39,31.24 12.54,31.39 IC1.2 14.4,31.51 14.4,32.65 IC1.1
  Bottom 0.254: v12.39,31.24 v12.39,27.91
S5_OUT  (via drill 0.51)
  Top 0.254: SJ2.2 24.16,30.36 23,31.51 | 23,31.51 R23.2 21.69,31.45 19.65,31.45 19.62,31.42 IC1.7 | v23.88,18.52 23.13,17.77 20.7,17.77 20.49,17.56 U$1.11 | 23,31.51 23.04,31.63 23.04,33.73 23.37,33.73 LSP1.MP
  Bottom 0.254: v23.88,18.52 23.4,19 23.4,33.73 LSP1.MP
S6_OUT  (via drill 0.51)
  Top 0.254: 40.17,20.65 39.35,21.48 | 39.35,21.48 36.42,24.4 C10.1 36.27,24.37 36.06,24.37 34.62,22.93 21.63,22.93 v21.6,22.9 | 40.17,20.65 40.17,20.11 R29.2 | R7.2 44.67,23.38 41.97,20.68 40.29,20.68 40.17,20.65 | v21.6,15.16 19.92,13.48 18.3,13.48 18.3,14.53 U$1.7 | IC2.1 36.51,20.29 37.62,21.4 39.27,21.4 39.35,21.48
  Bottom 0.254: v21.6,22.9 v21.6,15.16
S7_OUT  (via drill 0.51)
  Top 0.254: IC2.7 35.25,15.04 35.34,15.04 R26.2 35.25,12.67 34.47,11.89 v29.13,11.89 | v20.91,13.03 17.49,13.03 U$1.6
  Bottom 0.254: v20.91,13.03 22.05,11.89 v29.13,11.89
SAL_ENABLE  (via drill 0.51)
  Top 0.254: v10.62,5.59 11.58,4.63 R16.2 | v10.68,19.99 11.4,20.71 12.06,20.71 U$1.26
  Bottom 0.254: v10.62,5.59 10.68,5.65 v10.68,19.99
SALINITY  (via drill 0.51)
  Top 0.254: SALINITY1.1 11.64,2.86 11.61,2.89 R16.1 11.49,2.98 v9.84,4.63 | v14.04,16.39 16.5,16.39 16.92,15.97 19.05,15.97 19.05,14.56 U$1.8 | v12.36,13.78 11.37,12.79 v9.9,12.79
  Bottom 0.254: v14.04,16.39 12.36,14.71 v12.36,13.78 | v9.9,12.79 9.84,12.73 v9.84,4.63
SCL  (via drill 0.51)
  Top 0.254: SCL.1 R17.1 5.85,15.28 v6.84,16.27 | v8.61,23.59 9.81,24.79 14.1,24.79 14.76,24.13 17.46,24.13 17.46,22.96 U$1.19
  Bottom 0.254: v8.61,23.59 8.01,22.99 8.01,17.44 v6.84,16.27
SDA  (via drill 0.51)
  Top 0.254: SDA.1 R32.1 5.97,18.49 v7.05,19.57 | v17.22,21.55 16.71,22.06 16.68,22.06 U$1.20 | v8.61,24.7 v11.34,27.43
  Bottom 0.254: v17.22,21.55 16.92,21.85 16.92,34.36 14.49,36.79 11.34,36.79 v11.34,27.43 | v8.61,24.7 7.05,23.14 v7.05,19.57
SENSE_IN  (via drill 0.51)
  Top 0.254: v10.56,36.64 7.11,36.64 4.2,33.73 R9.2 | v18.3,17.98 19.53,16.75 20.46,16.75 U$1.10
  Bottom 0.254: v10.56,36.64 11.16,37.24 16.89,37.24 16.89,35.02 18.3,33.61 v18.3,17.98
U_TX  (via drill 0.51)
  Top 0.254: v13.47,18.28 12.12,18.28 12.09,18.31 U$1.29 | v14.19,36.01 14.43,36.25 v25.65,36.25
  Bottom 0.254: v13.47,18.28 13.38,18.37 13.38,27.19 13.62,27.43 13.62,32.41 12.72,33.31 12.72,34.54 v14.19,36.01 | v25.65,36.25 27.3,37.9 38.25,37.9 38.25,36.82 39.24,35.83 50.58,35.83 50.58,13.81 48.42,11.65 JP2.3
UD_STATE  (via drill 0.51)
  Top 0.254: 46.5,35.5 46.71,35.5 10K-TRIM3.3 | 46.5,35.5 41.01,35.5 40.26,36.25 39.96,36.25 10K-TRIM4.3 | v47.22,29.8 50K-TRIM.3 | v46.5,35.05 46.5,35.38 46.5,35.5 | v30.51,27.31 10K-TRIM1.3 | 10K-TRIM2.3 31.14,36.97 30.87,36.97 v30.24,36.34 30.12,36.37 29.01,37.48 12.3,37.48 12.3,35.68 12.78,35.2 13.47,35.2 v14.28,34.39 | v14.28,21.55 15.06,21.55 15.06,22.93 U$1.22
  Bottom 0.254: v47.22,29.8 46.5,30.52 46.5,33.52 | v46.5,35.05 46.5,33.52 | v30.51,27.31 30.24,27.58 30.24,33.52 | v30.24,36.34 30.24,33.52 | v14.28,34.39 v14.28,21.55 | 46.5,33.52 46.38,33.52 30.36,33.52 30.24,33.52

### Text on the board
_tsilk: Giskard42's Ultimate Ultrasonic Amplifier | R1 | 1k | R31 | SENSE1 | 0.1uf | 1k | R9 | C12 | 1k | R13 | 1M | 1k | 0.1uf | C6 | C18 | C3 | IC3 | 1k | IC1 | R23 | R25 | R30 | R11 | 100k | R24 | C20 | 1k | C19 | 1k | 5.1v | C8 | R21 | C17 | R15 | 1M | R3 | 1M | C16 | R18 | 0.1uf | C13 | 0.1uf | D5 | 1k | 0.01 uf | 0.1uf | 100k | R7 | R10 | C10 | 25k | SENSE2 | 1k | 1k | C21 | R29 | R5 | R22 | 25k | SDA | 0.1uf | 1k | 25k | R32 | R4 | 1k | IC2 | SCL | 10k | 0.1uf | C22 | R8 | R17 | 25k | GND | GND | 10k | BOOT | R27 | 10uf | R28 | 3v3 | C9 | L1 | 2.2uh | D6 | 1k | D3 | 16V | C2 | 10uf | C5 | 10uf | 1k | R26 | R2 | R14 | R12 | 100k | U_TX | Q7 | R20 | Q1 | 1k | Q6 | 1k | SWCK | C11 | 10uf | BSS123 | BSS84 | R19 | BSS123 | 10uf | SALINITY | Q9 | 1M | Q4 | D2 | SWIO | 5V | U2 | D4 | 16V | 16V | 10k | Q2 | R6 | RST | R16 | Q3 | Version 1 | BSS123 | 25k | PIEZO | PIEZO